# EAGLE design IOTFARM (EAGLE 9.6.2)
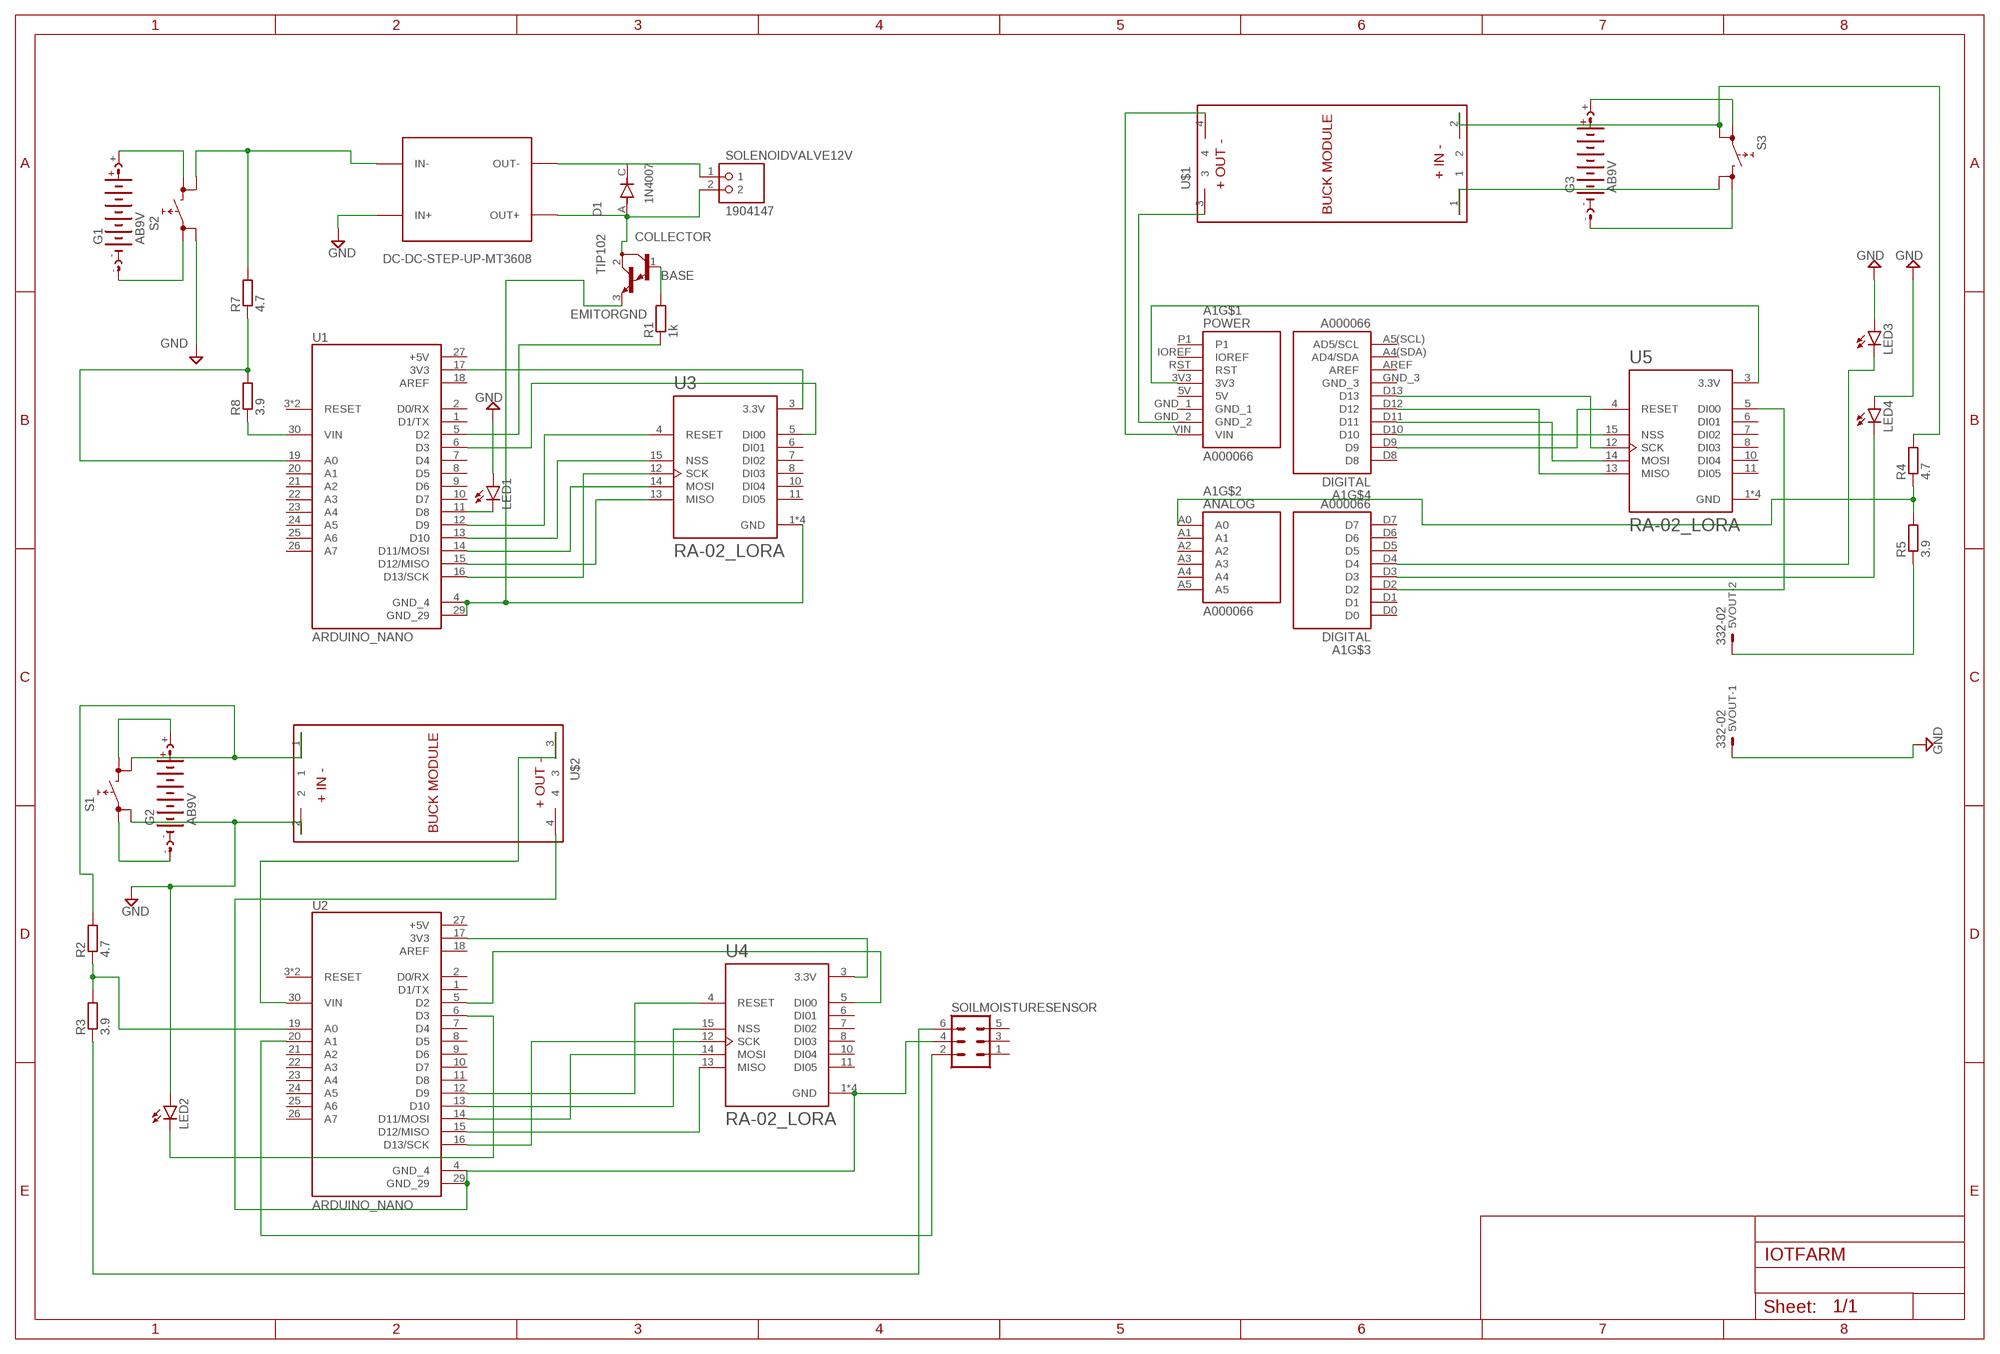
[diagram p0: schematic, sheet 1]

## Parts
5VOUT  332-02  [332-02]
A1  A000066  [ARDUINO_A000066]
D1  1N4007  [DIOAD1060W80L520D270]
G1  AB9V  [AB9V]
G2  AB9V  [AB9V]
G3  AB9V  [AB9V]
LED1  LED3MM  [LED3MM]
LED2  LED3MM  [LED3MM]
LED3  LED3MM  [LED3MM]
LED4  LED3MM  [LED3MM]
R1  1k  R-EU_0204/2V  [0204V]
R2  4.7  R-EU_0204/2V  [0204V]
R3  3.9  R-EU_0204/2V  [0204V]
R4  4.7  R-EU_0204/2V  [0204V]
R5  3.9  R-EU_0204/2V  [0204V]
R7  4.7  R-EU_0204/2V  [0204V]
R8  3.9  R-EU_0204/2V  [0204V]
S1  REKN  [REKN]
S2  REKN  [REKN]
S3  REKN  [REKN]
SOILMOISTURESENSOR  MA03-2  [MA03-2]
SOLENOIDVALVE12V  1904147  [PHOENIX_1904147]
U1  ARDUINO_NANO  [MODULE_ARDUINO_NANO]
U2  ARDUINO_NANO  [MODULE_ARDUINO_NANO]
U3  RA-02_LORA  [MODULE_RA-02_LORA]
U4  RA-02_LORA  [MODULE_RA-02_LORA]
U5  RA-02_LORA  [MODULE_RA-02_LORA]
U$1  BUCK_MODULEWITH_SMDPADS&THROUGHHOLES  [BUCK_MODULE]
U$2  BUCK_MODULEWITH_SMDPADS&THROUGHHOLES  [BUCK_MODULE]
U$3  DC-DC-STEP-UP-MT3608  [DC-DC-STEP-UP-MT3608]
U$4  TIP102  [TO220V]

## Nets
BASE: R1.2 U$4.1(B)
COLLECTOR: D1.A SOLENOIDVALVE12V.2 U$3.OUT+ U$4.2(C)
EMITORGND: U1.4(GND_4) U1.29(GND_29) U3.1(GND) U3.2(GND) U3.9(GND) U3.16(GND) U$4.3(E)
GND: 5VOUT.1 LED1.A LED2.A LED3.A LED4.A S1.0B S2.0B U$2.2 U$3.IN+
N$1: R7.2 S2.1B U$3.IN-
N$2: D1.C SOLENOIDVALVE12V.1 U$3.OUT-
N$3: LED1.K(C) U1.11(D8)
N$4: G2.+ S1.1A
N$5: R1.1 U1.5(D2)
N$6: U1.12(D9) U3.4(RESET)
N$7: G1.+ S2.1A
N$8: U1.13(D10) U3.15(NSS)
N$9: U1.6(D3) U3.5(DI00)
N$10: U1.16(D13/SCK) U3.12(SCK)
N$11: U1.15(D12/MISO) U3.13(MISO)
N$12: U1.14(D11/MOSI) U3.14(MOSI)
N$13: U1.17(3V3) U3.3(3.3V)
N$14: R8.1 U1.30(VIN)
N$15: R7.1 R8.2 U1.19(A0)
N$16: G1.- S2.0A
N$17: G2.- S1.0A
N$18: R2.2 S1.1B U$2.1
N$20: R3.1 SOILMOISTURESENSOR.6
N$23: U2.30(VIN) U$2.3
N$24: SOILMOISTURESENSOR.4 U2.4(GND_4) U2.29(GND_29) U4.1(GND) U4.2(GND) U4.9(GND) U4.16(GND) U$2.4
N$25: U2.17(3V3) U4.3(3.3V)
N$26: U2.12(D9) U4.4(RESET)
N$27: U2.14(D11/MOSI) U4.14(MOSI)
N$28: U2.15(D12/MISO) U4.13(MISO)
N$29: U2.16(D13/SCK) U4.12(SCK)
N$30: U2.13(D10) U4.15(NSS)
N$31: SOILMOISTURESENSOR.2 U2.20(A1)
N$32: R2.1 R3.2 U2.19(A0)
N$33: U2.5(D2) U4.5(DI00)
N$34: LED2.K(C) U2.6(D3)
N$36: G3.+ S3.0A
N$37: R4.2 S3.0B U$1.2
N$38: S3.1B U$1.1
N$39: A1.VIN U$1.4
N$40: A1.GND_2 U$1.3
N$41: A1.D9 U5.4(RESET)
N$42: A1.D11 U5.14(MOSI)
N$43: A1.D12 U5.13(MISO)
N$44: A1.D10 U5.15(NSS)
N$45: A1.D13 U5.12(SCK)
N$46: A1.3V3 U5.3(3.3V)
N$47: A1.D2 U5.5(DI00)
N$48: A1.D3 LED4.K(C)
N$49: A1.D4 LED3.K(C)
N$50: G3.- S3.1A
N$51: A1.A0 R4.1 R5.2
N$52: 5VOUT.2 R5.1
Unconnected: A1.A1 A1.A2 A1.A3 A1.A4 A1.A4(SDA)(AD4/SDA) A1.A5 A1.A5(SCL)(AD5/SCL) A1.AREF A1.D0 A1.D1 A1.D5 A1.D6 A1.D7 A1.D8 A1.IOREF A1.P1 A1.RST SOILMOISTURESENSOR.1 SOILMOISTURESENSOR.3 SOILMOISTURESENSOR.5 U1.1(D1/TX) U1.2(D0/RX) U1.3(RESET) U1.7(D4) U1.8(D5) U1.9(D6) U1.10(D7) U1.20(A1) U1.21(A2) U1.22(A3) U1.23(A4) U1.24(A5) U1.25(A6) U1.26(A7) U1.28(RESET) U2.1(D1/TX) U2.2(D0/RX) U2.3(RESET) U2.7(D4) U2.8(D5) U2.9(D6) U2.10(D7) U2.11(D8) U2.21(A2) U2.22(A3) U2.23(A4) U2.24(A5) U2.25(A6) U2.26(A7) U2.28(RESET) U3.6(DI01) U3.7(DI02) U3.8(DI03) U3.10(DI04) U3.11(DI05) U4.6(DI01) U4.7(DI02) U4.8(DI03) U4.10(DI04) U4.11(DI05) U5.6(DI01) U5.7(DI02) U5.8(DI03) U5.10(DI04) U5.11(DI05)

## Power pins joined to a net without a drawn wire
5V: A1.5V
+5V: U1.27(+5V) U2.27(+5V)
AREF: U1.18(AREF) U2.18(AREF)
GND: U5.1(GND) U5.2(GND) U5.9(GND) U5.16(GND)
GND_1: A1.GND_1
GND_3: A1.GND_3

## Library data of the parts
5VOUT = con-garry:332-02: 2 Pin - 2mm Dual Row Source: www.mpe-connector.de / garry_shortform_2012.pdf
A1 = A000066:A000066: Microcontroller board, Uno [Arduino] A000066 Microcontroller board, Uno 7640152110092 Check prices <https://pricing.snapeda.com/parts/A000066/Arduino/view-part?ref=eda> Check prices <https://pricing.snapeda.com/parts/A000066/Arduino/view-part?ref=eda> Check availability <https://pricing.snapeda.com/parts/ARDUINO%20UNO%20REV3%20DEVELOPMENT%20BOARD/Arduino/view-part?ref=eda>; AVAILABILITY: Not in stock; DESCRIPTION: Microcontroller board based on the ATmega328P; MF: Arduino; MP: ARDUINO UNO REV3 DEVELOPMENT BOARD; PACKAGE: None; PRICE: None
D1 = 1N4007:1N4007: Check availability <https://pricing.snapeda.com/parts/1N4007/Diotec%20Semiconductor/view-part?ref=eda>; AVAILABILITY: In Stock; CHECK_PRICES: https://www.snapeda.com/parts/1N4007/Diotec/view-part/?ref=eda; DESCRIPTION: Diode, DO-41, 1000V, 1A, 175°C; MF: Diotec Semiconductor; MP: 1N4007; PACKAGE: DO-41 Diotec; PRICE: None; SNAPEDA_LINK: https://www.snapeda.com/parts/1N4007/Diotec/view-part/?ref=snap
G1-G3 = battery:AB9V: 9-V BATTERY CLIP
LED1-LED4 = led:LED: LED OSRAM: - CHIPLED LG R971, LG N971, LY N971, LG Q971, LY Q971, LO R971, LY R971 LH N974, LH R974 LS Q976, LO Q976, LY Q976 LO Q996 - Hyper CHIPLED LW Q18S LB Q993, LB Q99A, LB R99A - SideLED LS A670, LO A670, LY A670, LG A670, LP A670 LB A673, LV A673, LT A673, LW A673 LH A674 LY A675 LS A676, LA A676, LO A676, LY A676, LW A676 LS A679, LY A679, LG A679 - Hyper Micro SIDELED® LS Y876, LA Y876, LO Y876, LY Y876 LT Y87S - SmartLED LW L88C, LW L88S LB L89C, LB L89S, LG L890 LS L89K, LO L89K, LY L89K LS L896, LA L896, LO L896, LY L896 - TOPLED LS T670, LO T670, LY T670, LG T670, LP T670 LSG T670, LSP T670, LSY T670, LOP T670, LYG T670 LG T671, LOG T671, LSG T671 LB T673, LV T673, LT T673, LW T673 LH T674 LS T676, LA T676, LO T676, LY T676, LB T676, LH T676, LSB T676, LW T676 LB T67C, LV T67C, LT T67C, LS T67K, LO T67K, LY T67K, LW E67C LS E67B, LA E67B, LO E67B, LY E67B, LB E67C, LV E67C, LT E67C LW T67C LS T679, LY T679, LG T679 LS T770, LO T770, LY T770, LG T770, LP T770 LB T773, LV T773, LT T773, LW T773 LH T774 LS E675, LA E675, LY E675, LS T675 LS T776, LA T776, LO T776, LY T776, LB T776 LHGB T686 LT T68C, LB T68C - Hyper Mini TOPLED® LB M676 - Mini TOPLED Santana® LG M470 LS M47K, LO M47K, LY M47K Source: http://www.osram.convergy.de LUXEON: - LUMILED® LXK2-PW12-R00, LXK2-PW12-S00, LXK2-PW14-U00, LXK2-PW14-V00 LXK2-PM12-R00, LXK2-PM12-S00, LXK2-PM14-U00 LXK2-PE12-Q00, LXK2-PE12-R00, LXK2-PE12-S00, LXK2-PE14-T00, LXK2-PE14-U00 LXK2-PB12-K00, LXK2-PB12-L00, LXK2-PB12-M00, LXK2-PB14-N00, LXK2-PB14-P00, LXK2-PB14-Q00 LXK2-PR12-L00, LXK2-PR12-M00, LXK2-PR14-Q00, LXK2-PR14-R00 LXK2-PD12-Q00, LXK2-PD12-R00, LXK2-PD12-S00 LXK2-PH12-R00, LXK2-PH12-S00 LXK2-PL12-P00, LXK2-PL12-Q00, LXK2-PL12-R00 Source: www.luxeon.com KINGBRIGHT: KA-3528ASYC Source: www.kingbright.com
R1-R5 R7 R8 = rcl:R-EU_: RESISTOR, European symbol; SPICEPREFIX: R
S1-S3 = switch:REKN: PUSH SWITCH ITT-Cannon-Cannon
SOILMOISTURESENSOR = con-lstb:MA03-2: PIN HEADER; OC_FARNELL: unknown; OC_NEWARK: unknown
SOLENOIDVALVE12V = 1904147:1904147: Check availability <https://pricing.snapeda.com/parts/1904147/RS%20Pro/view-part?ref=eda>; AVAILABILITY: Not in stock; CHECK_PRICES: https://www.snapeda.com/parts/1904147/RS+Pro/view-part/?ref=eda; DESCRIPTION: Solenoid Valve 3 Port Male 3/4in BSP In DN10 Out 24VAC/VDC NC Water 1MPa 2.8W | RS PRO 1904147; MF: RS Pro; MP: 1904147; PACKAGE: None; PRICE: None; SNAPEDA_LINK: https://www.snapeda.com/parts/1904147/RS+Pro/view-part/?ref=snap
U1 U2 = ARDUINO_NANO:ARDUINO_NANO: Check availability <https://pricing.snapeda.com/parts/Arduino%20Nano/Arduino/view-part?ref=eda>; AVAILABILITY: Not in stock; CHECK_PRICES: https://www.snapeda.com/parts/Arduino%20Nano/Arduino/view-part/?ref=eda; DESCRIPTION: Small, complete, and breadboard-friendly board based on the ATmega328 (Arduino Nano 3.x); MF: Arduino; MP: Arduino Nano; PACKAGE: Non-Standard Arduino; PRICE: None; SNAPEDA_LINK: https://www.snapeda.com/parts/Arduino%20Nano/Arduino/view-part/?ref=snap
U3-U5 = RA-02_LORA:RA-02_LORA: Ra-02 LoRa RF M5Stack Platform Evaluation Expansion Board Check availability <https://pricing.snapeda.com/parts/Ra-02%20LoRa/AI-Thinker/view-part?ref=eda>; AVAILABILITY: In Stock; DESCRIPTION: Ra-02 LoRa RF M5Stack Platform Evaluation Expansion Board; MF: AI-Thinker; MP: Ra-02 LoRa; PACKAGE: None; PRICE: None; PURCHASE-URL: https://pricing.snapeda.com/search/part/Ra-02 LoRa/?ref=eda
U$1 U$2 = BUCK_MODULE:BUCK_MODULE
U$3 = dc-dc-boost-2a-microusb-mt3608:DC-DC-STEP-UP-MT3608: DC/DC Step-Up Regulator based on MT3608 chip MT3608 datasheet available here: https://www.olimex.com/Products/Breadboarding/BB-PWR-3608/resources/MT3608.pdf Click here to find device on ebay.com <http://www.ebay.com/sch/mt3608+module>
U$4 = TIP102:TIP102: Check availability <https://pricing.snapeda.com/parts/TIP102/NTE%20Electronics%2C%20Inc/view-part?ref=eda>; AVAILABILITY: Not in stock; CHECK_PRICES: https://www.snapeda.com/parts/TIP102/NTE+Electronics/view-part/?ref=eda; DESCRIPTION: TRANSISTOR NPN SILICON DARLINGTON 100V IC=8A TO-220 CASE WITH BASE-EMITTER SHUNT | NTE Electronics Inc. TIP102; MF: NTE Electronics, Inc; MP: TIP102; PACKAGE: Package; PRICE: None; SNAPEDA_LINK: https://www.snapeda.com/parts/TIP102/NTE+Electronics/view-part/?ref=snap

## Board
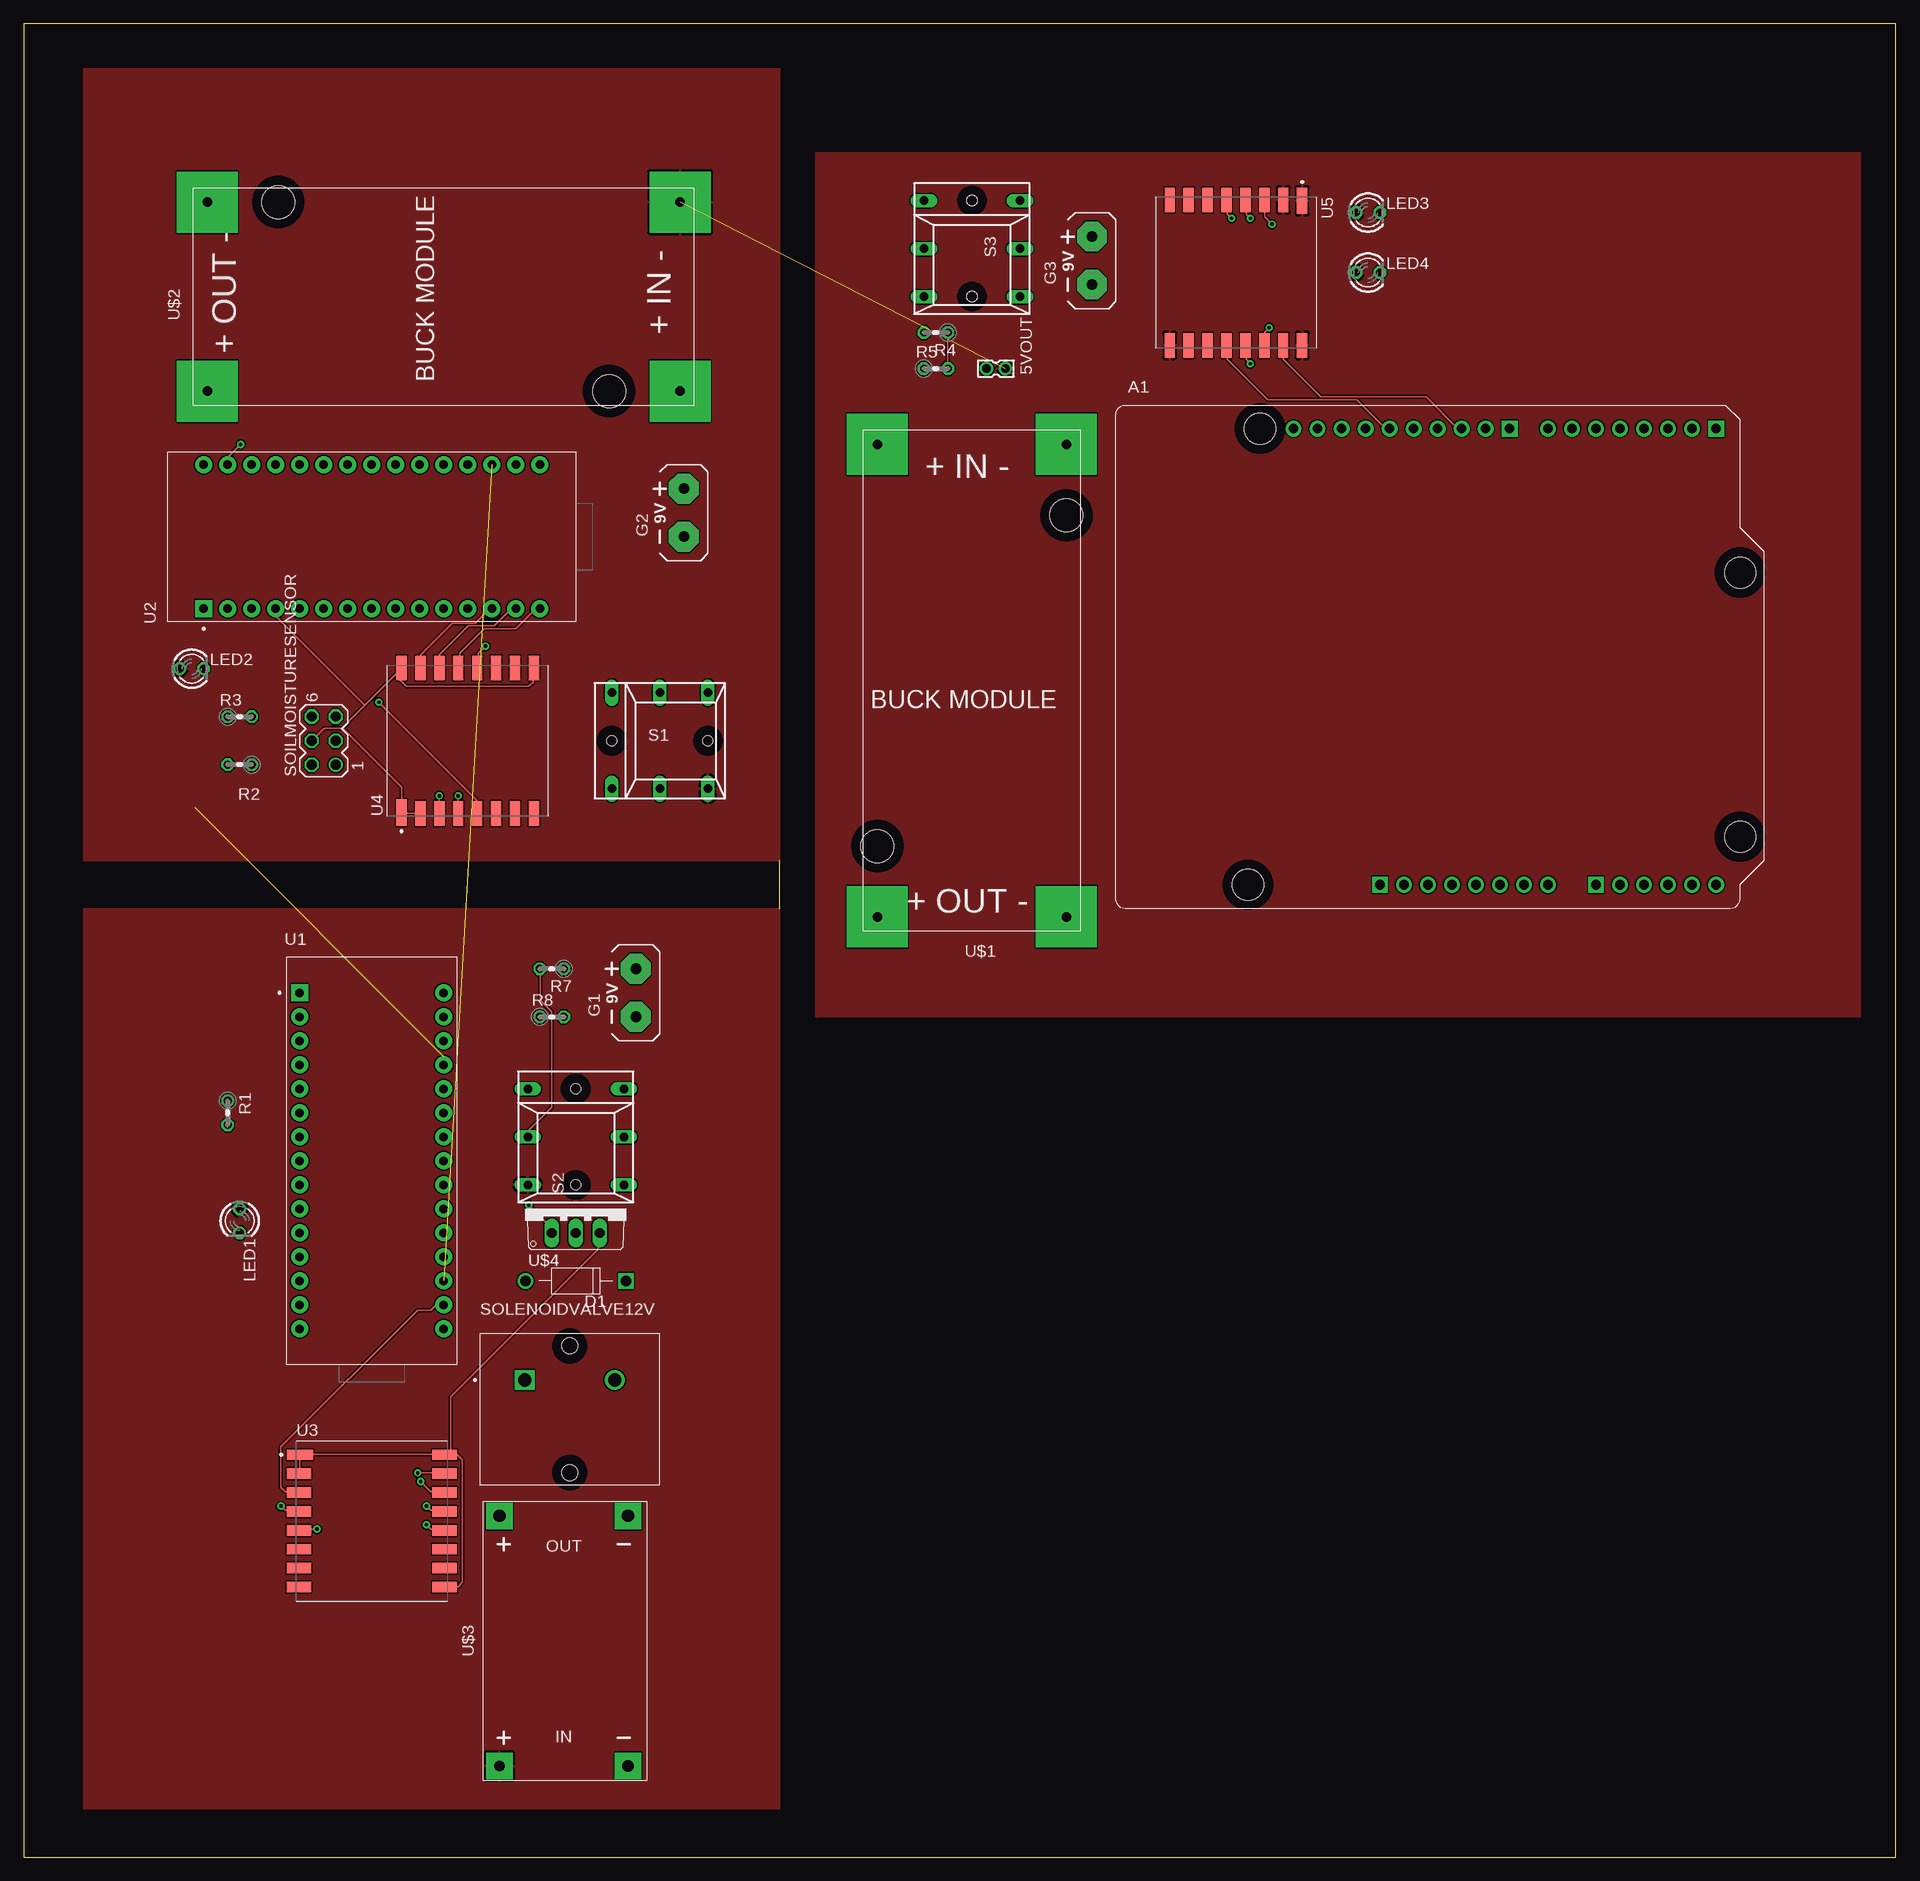
[diagram p1: board, top side]
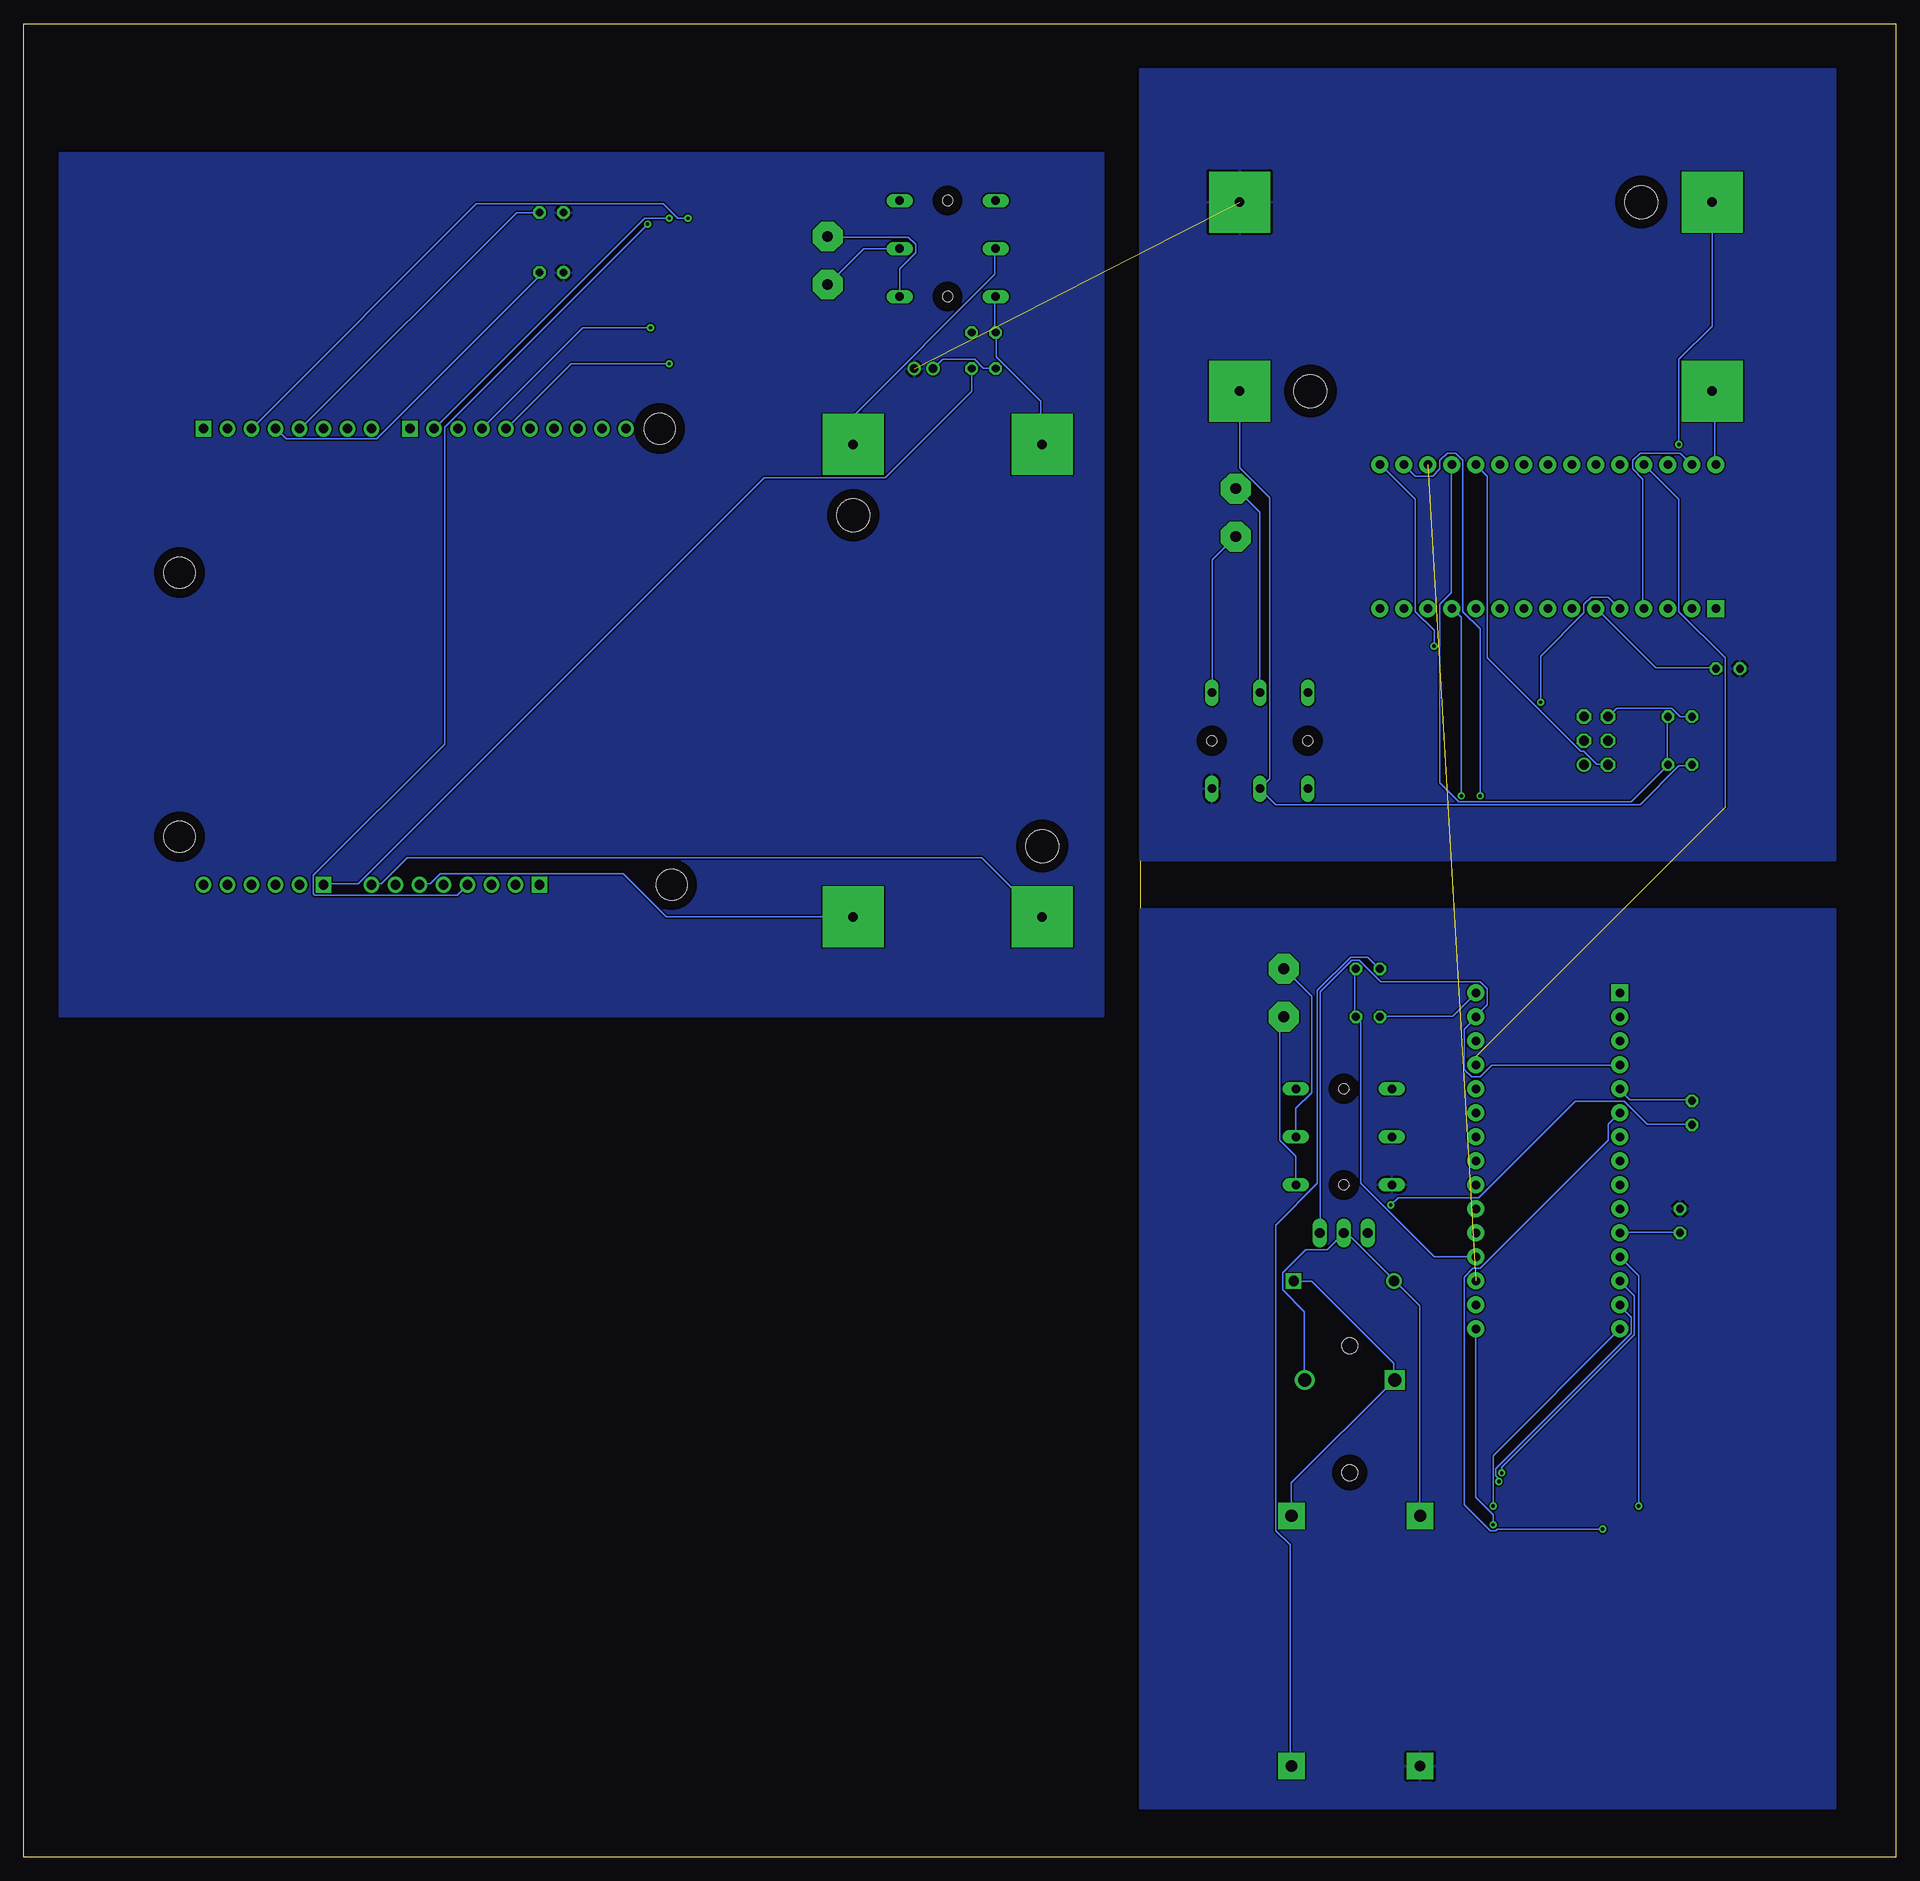
[diagram p2: board, bottom side, seen from below]

Size 198.1 x 193.98 mm. Coordinates in mm from the lower left corner, seen from the top.
Outline: 0,0 198.1,0 198.1,193.98 0,193.98 0,0
Copper layers (1*16): Top 0.035mm / dielectric 1.5mm / Bottom 0.035mm
Design rules "default": minimum track width 6mil, minimum drill 0.35mm, track to track 6mil, track to pad 6mil, pad to pad 6mil, via to via 6mil, smd to smd 6mil, copper to edge 40mil, drill to drill 6mil, minimum pad ring 10mil, minimum via ring 8mil, stop-mask expansion 4mil, vias tented up to drill 0mil, thermal gap 10mil

### Footprints (pad centres in the part's own frame; a part is rotated, then mirrored left to right if it is on the bottom)
332-02 = drill 0.9 pad 1.27: 1 0,-1; 2 0,1
ARDUINO_A000066 = drill 1.016 pad 1.676: 3V3 35.56,2.54; 5V 38.1,2.54; A1 53.34,2.54; A2 55.88,2.54; A3 58.42,2.54; A4 60.96,2.54; A4(SDA) 21.336,50.8; A5 63.5,2.54; A5(SCL) 18.796,50.8; AREF 23.876,50.8; D1 60.96,50.8; D2 58.42,50.8; D3 55.88,50.8; D4 53.34,50.8; D5 50.8,50.8; D6 48.26,50.8; D7 45.72,50.8; D9 39.116,50.8; D10 36.576,50.8; D11 34.036,50.8; D12 31.496,50.8; D13 28.956,50.8; GND_1 43.18,2.54; GND_2 40.64,2.54; GND_3 26.416,50.8; IOREF 30.48,2.54; RST 33.02,2.54; VIN 45.72,2.54 | drill 1.016 pad 1.676 square: A0 50.8,2.54; D0 63.5,50.8; D8 41.656,50.8; P1 27.94,2.54 | hole 3.3: 66.04,35.56; 66.04,7.62; 15.24,50.8; 13.97,2.54
DIOAD1060W80L520D270 = drill 1.1 pad 1.65: A 5.3,0 | drill 1.1 pad 1.65 square: C -5.3,0
AB9V = drill 1.118 pad 3.15 octagon: + 0,2.54; - 0,-2.54
LED3MM = drill 0.813 octagon: A -1.27,0; K 1.27,0
0204V = drill 0.813 octagon: 1 -1.27,0; 2 1.27,0
REKN = drill 0.9 long: 0A 5.08,5.08; 0B 5.08,-5.08; 1A 0,5.08; 1B 0,-5.08; A -5.08,5.08; B -5.08,-5.08 | hole 1.1: -5.08,0; 5.08,0
MA03-2 = drill 1.016: 1 -2.54,-1.27 | drill 1.016 octagon: 2 -2.54,1.27; 3 0,-1.27; 4 0,1.27; 5 2.54,-1.27; 6 2.54,1.27
PHOENIX_1904147 = drill 1.4 square: 1 4.76,11.1 | drill 1.4: 2 14.28,11.1 | hole 1.7: 9.52,1.3; 9.52,14.7
MODULE_ARDUINO_NANO = drill 0.9 pad 1.8 square: 1 -7.62,17.78 | drill 0.9 pad 1.8: 2 -7.62,15.24; 3 -7.62,12.7; 4 -7.62,10.16; 5 -7.62,7.62; 6 -7.62,5.08; 7 -7.62,2.54; 8 -7.62,0; 9 -7.62,-2.54; 10 -7.62,-5.08; 11 -7.62,-7.62; 12 -7.62,-10.16; 13 -7.62,-12.7; 14 -7.62,-15.24; 15 -7.62,-17.78; 16 7.62,-17.78; 17 7.62,-15.24; 18 7.62,-12.7; 19 7.62,-10.16; 20 7.62,-7.62; 21 7.62,-5.08; 22 7.62,-2.54; 23 7.62,0; 24 7.62,2.54; 25 7.62,5.08; 26 7.62,7.62; 27 7.62,10.16; 28 7.62,12.7; 29 7.62,15.24; 30 7.62,17.78
MODULE_RA-02_LORA = smd 2.8 x 1.1: 1 -7.6,7 | smd 2.6 x 1.1: 2 -7.7,5; 3 -7.7,3; 4 -7.7,1; 5 -7.7,-1; 6 -7.7,-3; 7 -7.7,-5; 8 -7.7,-7; 9 7.7,-7; 10 7.7,-5; 11 7.7,-3; 12 7.7,-1; 13 7.7,1; 14 7.7,3; 15 7.7,5; 16 7.7,7
BUCK_MODULE = drill 1 pad 6.452 square: 1 -10,-25; 2 10,-25; 3 -10,25; 4 10,25 | hole 3.5: -10,-17.5; 10,17.5
DC-DC-STEP-UP-MT3608 = drill 1.1 pad 2.8 square: IN+ -13.24,6.81 | drill 1.2 pad 2.8 square: IN- -13.24,-6.81 | drill 1.3 pad 2.8 square: OUT+ 13.24,6.81; OUT- 13.24,-6.81
TO220V = drill 1.016 long: 1 -2.54,-2.54; 2 0,-2.54; 3 2.54,-2.54

### Placement (x,y rotation side)
5VOUT  102.87,157.48 90 top
A1  115.57,100.33 0 top
D1  58.42,60.96 180 top
G1  64.77,91.44 0 top
G2  69.85,142.24 0 top
G3  113.03,168.91 0 top
LED1  22.86,67.31 270 top
LED2  17.78,125.73 0 top
LED3  142.24,173.99 0 top
LED4  142.24,167.64 0 top
R1  21.59,78.74 270 top
R2  22.86,115.57 180 top
R3  22.86,120.65 0 top
R4  96.52,161.29 180 top
R5  96.52,157.48 0 top
R7  55.88,93.98 180 top
R8  55.88,88.9 0 top
S1  67.31,118.11 0 top
S2  58.42,76.2 270 top
S3  100.33,170.18 270 top
SOILMOISTURESENSOR  31.75,118.11 90 top
SOLENOIDVALVE12V  48.26,39.37 0 top
U1  36.83,73.66 0 top
U2  36.83,139.7 90 top
U3  36.83,35.56 0 top
U4  46.99,118.11 90 top
U5  128.27,167.64 270 top
U$1  100.33,124.46 180 top
U$2  44.45,165.1 90 top
U$3  57.15,22.86 90 top
U$4  58.42,68.58 0 top

### Tracks (layer width: path | path; a pad name or v marks a point on that pad's centre or on a via)
+5V  (1 unrouted)
  Bottom 0.152: 44.45,84.68 U1.27 | 18.08,111.05 18.08,126.9 22.96,131.78 22.96,143.66 26.62,147.32 U2.27
AREF  (1 unrouted)
BASE  (via drill 0.35)
  Top 0.152: v53.44,68.99 55.88,66.55 U$4.1
  Bottom 0.152: v53.44,68.99 52.68,69.75 44.14,69.75 33.93,79.96 28.75,79.96 26.31,77.52 21.59,77.52 R1.2
COLLECTOR
  Bottom 0.152: SOLENOIDVALVE12V.2 62.59,50.55 62.59,57.71 64.87,59.99 64.87,61.82 62.43,64.26 60.15,64.26 58.47,65.94 U$4.2 58.32,65.94 58.01,65.94 53.14,61.06 D1.A 52.98,60.91 50.39,58.32 50.39,36.22 U$3.OUT+
EMITORGND
  Top 0.152: U3.2 29.21,40.64 29.21,42.47 U3.1 29.36,42.62 44.45,42.62 U3.16 | 45.21,42.62 44.6,42.62 U3.16 | 45.21,42.62 45.82,42.62 46.43,42.01 46.43,29.06 45.97,28.6 44.6,28.6 U3.9 | 45.21,42.62 45.21,48.72 60.76,64.26 60.76,64.41 60.91,64.57 60.91,65.94 U$4.3 | 45.21,42.62 U3.16
  Bottom 0.152: U$4.3 60.91,66.09 60.91,91.54 57.56,94.89 56.79,94.89 54.51,92.61 43.99,92.61 43.23,91.85 43.23,90.17 44.45,88.95 U1.29 44.45,88.8 45.67,87.58 45.67,83.31 44.91,82.55 43.99,82.55 42.77,83.77 29.21,83.77 U1.4
GND  (2 unrouted)
  Top 0.152: 79.96,105.41 80.01,105.41 | 79.96,100.38 80.01,100.33
  pour Top: 77.47,105.41 6.35,105.41 6.35,189.23 80.01,189.23 80.01,105.41
  pour Top: 6.35,100.33 80.01,100.33 80.01,5.08 6.35,5.08
  pour Top: 83.82,88.9 194.31,88.9 194.31,180.34 83.82,180.34
  pour Bottom: 6.35,189.23 6.35,105.41 80.01,105.41 80.01,189.23
  pour Bottom: 83.82,180.34 83.82,88.9 194.31,88.9 194.31,180.34
  pour Bottom: 6.35,100.33 80.01,100.33 80.01,5.08 6.35,5.08
N$1
  Top 0.152: R7.2 54.66,93.98 54.66,90.63 55.88,89.41 55.88,79.35 53.44,76.91 53.44,76.3 S2.1B
  Bottom 0.152: U$3.IN- 64.11,9.7 64.11,33.02 65.63,34.54 65.63,66.85 61.21,71.27 61.21,91.69 57.71,95.2 55.88,95.2 54.66,93.98 R7.2
N$2
  Bottom 0.152: D1.C 63.65,60.91 61.82,60.91 53.14,52.22 53.14,50.55 SOLENOIDVALVE12V.1 53.14,50.39 63.96,39.57 63.96,36.22 U$3.OUT-
N$3
  Bottom 0.152: LED1.K 22.96,66.09 29.21,66.09 U1.11
N$4
  Bottom 0.152: S1.1A 67.31,142.29 69.75,144.73 G2.+
N$5
  Bottom 0.152: R1.1 21.59,80.11 28.14,80.11 29.21,81.18 U1.5
N$6  (via drill 0.35)
  Top 0.152: v27.23,37.14 27.69,36.68 29.06,36.68 U3.4
  Bottom 0.152: v27.23,37.14 27.23,61.52 U1.12
N$7
  Bottom 0.152: S2.1A 63.5,79.2 61.82,80.87 61.82,91.08 64.72,93.98 G1.+
N$8  (via drill 0.35)
  Top 0.152: v41.71,40.64 44.45,40.64 U3.15
  Bottom 0.152: v41.71,40.64 41.71,41.25 27.69,55.27 27.69,59.38 29.21,60.91 U1.13
N$9  (via drill 0.35)
  Top 0.152: v31.04,34.7 29.21,34.7 U3.5
  Bottom 0.152: v31.04,34.7 42.16,34.7 42.32,34.54 42.93,34.54 45.67,37.29 45.67,61.37 44.75,62.28 43.99,62.28 30.43,75.84 30.43,77.52 U1.6
N$10  (via drill 0.35)
  Top 0.152: v42.62,35.15 43.08,34.7 44.45,34.7 U3.12
  Bottom 0.152: v42.62,35.15 42.62,36.22 44.45,38.05 U1.16
N$11  (via drill 0.35)
  Top 0.152: v42.62,37.14 43.08,36.68 44.45,36.68 U3.13
  Bottom 0.152: v42.62,37.14 42.62,42.47 U1.15
N$12  (via drill 0.35)
  Top 0.152: v42.01,39.73 43.08,38.66 44.45,38.66 U3.14
  Bottom 0.152: v42.01,39.73 42.01,40.03 42.32,40.33 42.32,41.1 27.99,55.42 27.99,57.1 29.21,58.32 U1.14
N$13
  Top 0.152: U3.3 29.06,38.66 27.69,38.66 27.23,39.12 27.23,43.38 41.71,57.86 43.08,57.86 43.54,58.32 44.45,58.32 U1.17
N$14
  Bottom 0.152: R8.1 54.51,88.95 46.89,88.95 44.45,91.39 U1.30
N$15
  Bottom 0.152: R7.1 57.25,93.98 57.25,88.95 R8.2 57.1,88.8 56.64,88.34 56.64,71.27 48.87,63.5 U1.19
N$16
  Bottom 0.152: S2.0A 63.5,74.17 65.18,75.84 65.18,88.49 G1.-
N$17
  Bottom 0.152: S1.0A 72.34,123.24 72.34,137.26 69.9,139.7 G2.-
N$18
  Bottom 0.152: R2.2 21.59,115.47 22.96,115.47 27.08,111.35 65.63,111.35 S1.1B 66.24,114.1 66.24,143.81 69.44,147.02 U$2.1
N$20
  Bottom 0.152: R3.1 22.81,120.65 23.72,121.56 29.52,121.56 30.43,120.65 SOILMOISTURESENSOR.6
N$23
  Bottom 0.152: U2.30 19.15,147.32 19.15,154.94 19.3,155.09 U$2.3
N$24  (via drill 0.35)
  Top 0.152: U4.2 41.86,110.44 40.03,110.44 U4.1 40.03,110.59 40.03,113.18 33.78,119.43 | 36.07,121.87 34.39,120.19 34.39,120.04 33.78,119.43 | 36.07,121.87 39.57,125.37 | 39.57,125.37 39.88,125.68 U4.16 39.57,125.37 | 33.78,119.43 31.8,119.43 SOILMOISTURESENSOR.4 | 39.57,125.37 39.57,124.77 40.49,123.85 53.44,123.85 53.9,124.31 53.9,125.68 U4.9 | 36.07,121.87 26.77,131.17 26.77,132.08 U2.4 | v22.96,149.45 21.59,148.08 U2.29
  Bottom 0.152: U2.29 22.81,148.54 27.08,148.54 27.84,147.78 27.84,146.86 26.77,145.8 26.77,132.08 U2.4 | v22.96,149.45 22.96,158.45 19.46,161.95 19.46,175.06 U$2.4
N$25  (via drill 0.35)
  Top 0.152: v43.99,112.27 43.99,110.44 U4.3
  Bottom 0.152: v43.99,112.27 43.99,129.95 45.82,131.78 45.82,147.78 46.58,148.54 47.5,148.54 48.26,147.78 48.26,146.86 49.02,146.1 50.85,146.1 U2.17
N$26  (via drill 0.35)
  Top 0.152: v45.97,112.27 45.97,110.44 U4.4
  Bottom 0.152: v45.97,112.27 45.97,131.17 46.89,132.08 U2.12
N$27
  Top 0.152: U2.14 51.61,132.08 49.78,130.25 47.04,130.25 43.99,127.2 43.99,125.83 U4.14
N$28
  Top 0.152: U2.15 54.2,132.08 52.07,129.95 48.72,129.95 46.13,127.36 46.13,125.83 U4.13
N$29  (via drill 0.35)
  Top 0.152: v48.87,128.12 48.11,127.36 48.11,125.83 U4.12
  Bottom 0.152: v48.87,128.12 48.87,129.79 50.85,131.78 50.85,143.66 54.51,147.32 U2.16
N$30
  Top 0.152: U2.13 49.33,132.08 47.8,130.56 45.36,130.56 42.01,127.2 42.01,125.83 U4.15
N$31
  Bottom 0.152: U2.20 43.23,146.1 43.23,126.9 33.32,116.99 33.02,116.99 31.65,115.62 30.58,115.62 SOILMOISTURESENSOR.2
N$32
  Bottom 0.152: R3.2 24.18,120.65 24.18,115.62 R2.1 24.18,115.47 27.99,111.66 46.28,111.66 48.26,113.64 48.26,132.54 47.04,133.76 47.04,147.32 U2.19
N$33  (via drill 0.35)
  Top 0.152: v37.59,122.17 47.95,111.81 47.95,110.44 U4.5
  Bottom 0.152: v37.59,122.17 37.59,127.05 33.02,131.62 33.02,132.54 32.26,133.3 30.43,133.3 U2.5
N$34
  Bottom 0.152: LED2.K 19.15,125.83 25.4,125.83 31.65,132.08 U2.6
N$36
  Bottom 0.152: S3.0A 105.41,168.05 103.73,169.72 103.73,170.64 104.5,171.4 113.03,171.4 G3.+
N$37
  Bottom 0.152: S3.0B 95.35,165 95.35,161.34 R4.2 95.2,161.19 95.2,158.75 90.47,154.03 90.47,149.61 U$1.2
N$38
  Bottom 0.152: S3.1B 95.35,170.18 95.35,167.44 110.29,152.5 110.29,149.61 U$1.1
N$39
  Bottom 0.152: A1.VIN 161.19,102.97 160.27,102.97 157.53,105.71 96.72,105.71 90.47,99.47 U$1.4
N$40
  Bottom 0.152: A1.GND_2 156.16,102.97 155.09,102.97 154.03,104.04 134.67,104.04 130.1,99.47 110.44,99.47 U$1.3
N$41  (via drill 0.35)
  Top 0.152: v129.79,173.38 129.34,173.84 129.34,175.21 U5.4
  Bottom 0.152: v129.79,173.38 132.38,173.38 154.63,151.13 A1.D9
N$42  (via drill 0.35)
  Top 0.152: v131.77,161.8 131.32,161.34 131.32,159.97 U5.14
  Bottom 0.152: v131.77,161.8 138.94,161.8 A1.D11
N$43  (via drill 0.35)
  Top 0.152: v129.79,157.99 129.34,158.45 129.34,159.82 U5.13
  Bottom 0.152: v129.79,157.99 140.16,157.99 147.01,151.13 A1.D12
N$44
  Top 0.152: A1.D10 151.74,151.13 148.39,154.48 137.26,154.48 133.3,158.45 133.3,159.82 U5.15
N$45
  Top 0.152: A1.D13 144.12,151.13 141.07,154.18 131.62,154.18 127.36,158.45 127.36,159.82 U5.12
N$46  (via drill 0.35)
  Top 0.152: v132.08,172.77 131.32,173.53 131.32,175.21 U5.3
  Bottom 0.152: v132.08,172.77 153.57,151.28 153.57,117.75 167.44,103.89 167.44,101.91 167.28,101.75 152.2,101.75 151.13,102.82 A1.3V3
N$47  (via drill 0.35)
  Top 0.152: v127.81,173.38 127.36,173.84 127.36,175.21 U5.5
  Bottom 0.152: v127.81,173.38 128.88,173.38 130.4,174.9 150.22,174.9 A1.D2
N$48
  Bottom 0.152: LED4.K 143.51,167.28 160.73,150.06 170.33,150.06 171.4,151.13 A1.D3
N$49
  Bottom 0.152: LED3.K 145.95,173.99 168.81,151.13 A1.D4
N$50
  Bottom 0.152: S3.1A 109.22,170.18 G3.-
N$51
  Top 0.152: R4.1 R5.2
  Bottom 0.152: R5.2 97.79,155.09 106.93,145.95 119.74,145.95 162.71,102.97 166.37,102.97 A1.A0
N$52
  Bottom 0.152: R5.1 95.35,157.53 96.57,157.53 97.48,158.45 100.84,158.45 101.75,157.53 5VOUT.2